# Altium schematic sheet IMU.SchDoc
size A4
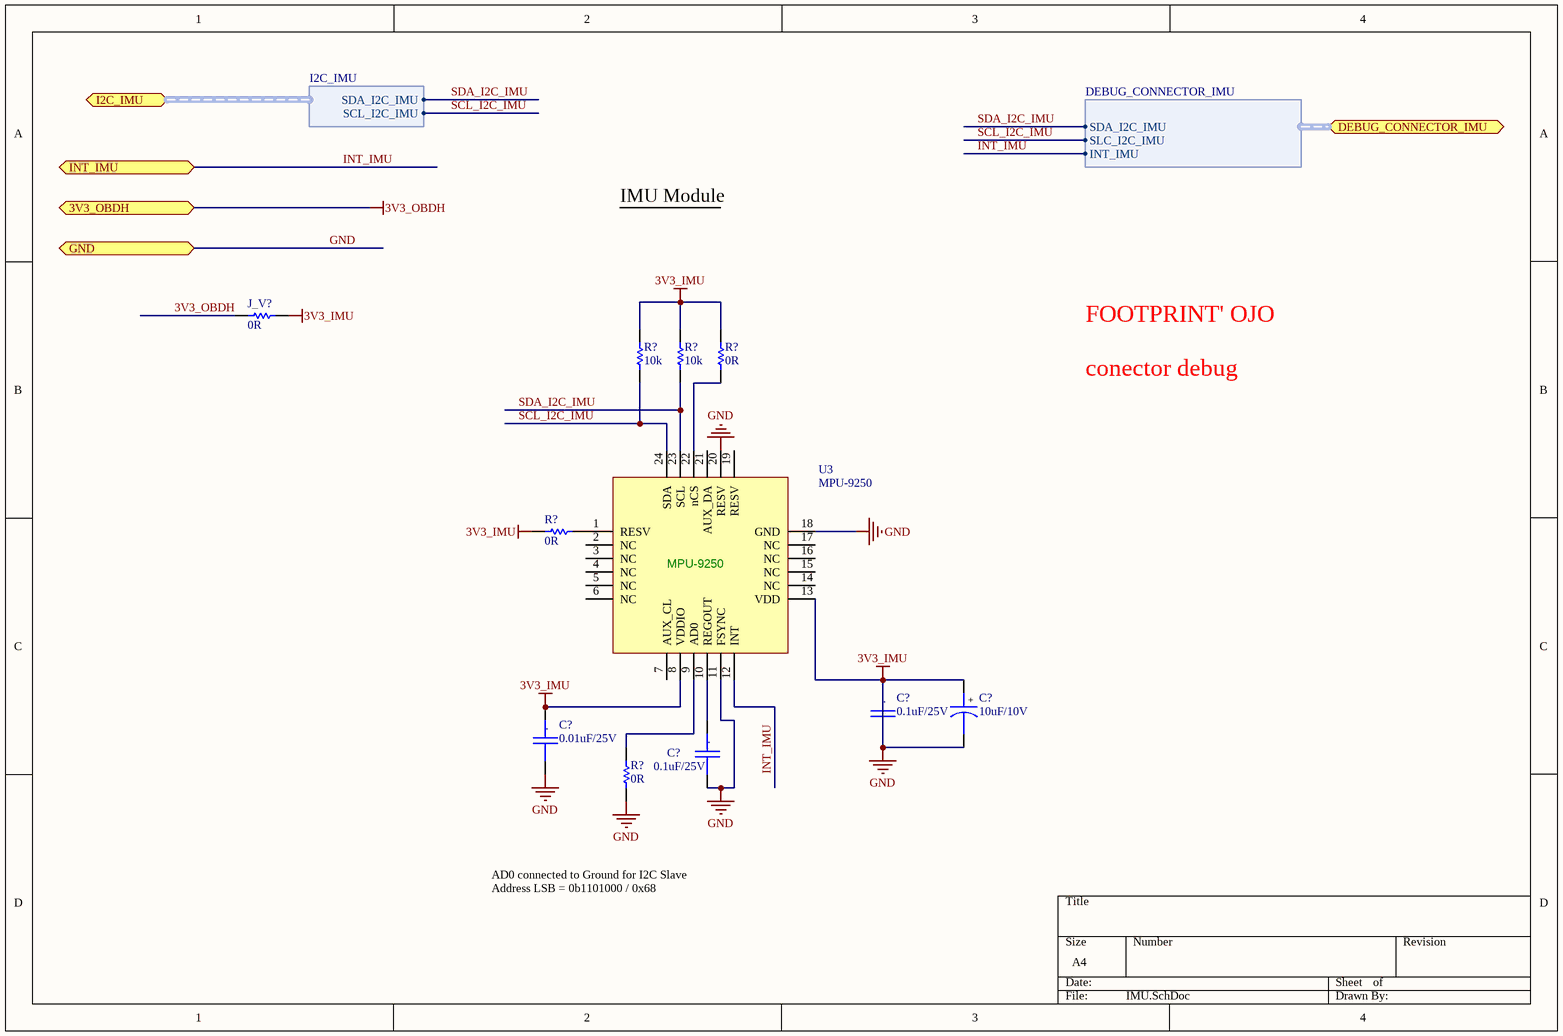
[diagram p0: IMU.SchDoc]

## Parts
(Parts that share a designator on the sheet are numbered #1, #2 ... from top to bottom, then left to right.)
C?#1  0.1uF/25V  [CC0805]
C?#2  10uF/10V  [CC0805_Tantalum]
C?#3  0.01uF/25V  [CC0805]
C?#4  0.1uF/25V  [CC0805]
J_V?  0R  [0805]
R?#1  10k  [0805]
R?#2  10k  [0805]
R?#3  0R  [0805]
R?#4  0R  [0805]
R?#5  0R  [0805]
U3  MPU-9250  [LGA24]

## Ports
3V3_OBDH, DEBUG_CONNECTOR_IMU (harness DEBUG_CONNECTOR_IMU), GND, I2C_IMU (harness I2C_IMU), INT_IMU

## Harnesses
DEBUG_CONNECTOR_IMU: SDA_I2C_IMU, SLC_I2C_IMU, INT_IMU
I2C_IMU: SCL_I2C_IMU, SDA_I2C_IMU

## Nets
3V3_OBDH: J_V?.2 ; port 3V3_OBDH
GND: C?#1.1 C?#1.2 C?#2.1 C?#2.2 C?#3.1 C?#3.2 C?#4.2 J_V?.1 R?#1.2 R?#2.2 R?#3.2 R?#4.2 R?#5.2 U3.8(VDDIO) U3.11(FSYNC) U3.13(VDD) U3.18(GND) U3.20(RESV) ; port GND  [also labelled 3V3_IMU]
INT_IMU: U3.12(INT) ; port INT_IMU, port DEBUG_CONNECTOR_IMU.INT_IMU
SCL_I2C_IMU: R?#1.1 U3.24(SDA) ; port DEBUG_CONNECTOR_IMU.SLC_I2C_IMU, port I2C_IMU.SCL_I2C_IMU
SDA_I2C_IMU: R?#2.1 U3.23(SCL) ; port DEBUG_CONNECTOR_IMU.SDA_I2C_IMU, port I2C_IMU.SDA_I2C_IMU
NetC?#4_1: C?#4.1 U3.10(REGOUT)
NetR?#3_1: R?#3.1 U3.22(nCS)
NetR?#4_1: R?#4.1 U3.1(RESV)
NetR?#5_1: R?#5.1 U3.9(AD0)

Not connected (* = marked no-connect by the designer): U3 2(NC) 3(NC) 4(NC) 5(NC) 6(NC) 7(AUX_CL) 14(NC) 15(NC) 16(NC) 17(NC) 19(RESV) 21(AUX_DA)

## Notes on the sheet
- IMU Module
- FOOTPRINT' OJO
- conector debug
- AD0 connected to Ground for I2C Slave
  Address LSB = 0b1101000 / 0x68
- (in symbol Cap_Cer_X7R_0.1uF_25V_0805) .
- (in symbol Cap_Cer_X7R_0.01uF_50V_0805) .
- (in symbol Cap_Tant_SMD_10uF_10V_0805) +

## Library data of the parts
C?#1 C?#4 = Cap_Cer_X7R_0.1uF_25V_0805: CAP CER 0.1UF 25V 10% X7R 0805; Partnumber: CC0805KRX7R8BB104; NCM: 8532.24.10
C?#2 = Cap_Tant_SMD_10uF_10V_0805: CAP Tantalum 10uF 10V 20% 0805; Partnumber: TPSP106M010R2000; NCM: 8532.21.11
C?#3 = Cap_Cer_X7R_0.01uF_50V_0805: CAP CER 0.01uF 25V 10% X7R 0805; Partnumber: CL21B103KAANNNC; NCM: 8532.24.10
J_V? = R0R_JUMPER_1/16W_0805: RES 0R OHM 1/16W JUMPER 0805; Partnumber: CRCW08050000Z0EA; NCM: 8533.21.20
R?#1 R?#2 = R10k_1%_1/8W_0805: RES 10K OHM 1/8W 1%  0805; Partnumber: CRCW080510K0FKEA; NCM: 8533.21.20
R?#3-R?#5 = R0R_JUMPER_1/16W_0805: RES 0R OHM 1/16W JUMPER 0805; Partnumber: CRCW12060000Z0EAHP; NCM: 8533.21.20
U3 = MPU9250: Partnumber: MPU-9250